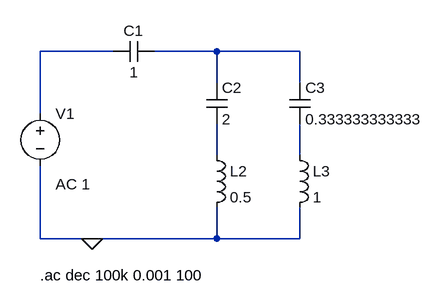
[diagram p0: schematic 2.asc]
2.asc, the LTspice schematic file:
Version 4
SHEET 1 880 680
WIRE 112 112 0 112
WIRE 272 112 176 112
WIRE 400 112 272 112
WIRE 272 160 272 112
WIRE 400 160 400 112
WIRE 0 208 0 112
WIRE 272 272 272 224
WIRE 400 272 400 224
WIRE 0 400 0 288
WIRE 80 400 0 400
WIRE 272 400 272 352
WIRE 272 400 80 400
WIRE 400 400 400 352
WIRE 400 400 272 400
FLAG 80 400 0
SYMBOL cap 176 96 R90
WINDOW 0 0 32 VBottom 2
WINDOW 3 32 32 VTop 2
SYMATTR InstName C1
SYMATTR Value 1
SYMBOL cap 256 160 R0
SYMATTR InstName C2
SYMATTR Value 2
SYMBOL cap 384 160 R0
SYMATTR InstName C3
SYMATTR Value 0.333333333333
SYMBOL ind 256 256 R0
SYMATTR InstName L2
SYMATTR Value 0.5
SYMBOL ind 384 256 R0
SYMATTR InstName L3
SYMATTR Value 1
SYMBOL voltage 0 192 R0
WINDOW 123 24 124 Left 2
WINDOW 39 0 0 Left 0
SYMATTR Value2 AC 1
SYMATTR InstName V1
SYMATTR Value ""
TEXT 0 456 Left 2 !.ac dec 100k 0.001 100

The netlist it stands for:
* 2.asc
C1 N002 N001 1
C2 N002 N003 2
C3 N002 N004 0.333333333333
L2 N003 0 0.5
L3 N004 0 1
V1 N001 0 AC 1
.ac dec 100k 0.001 100
.backanno
.end